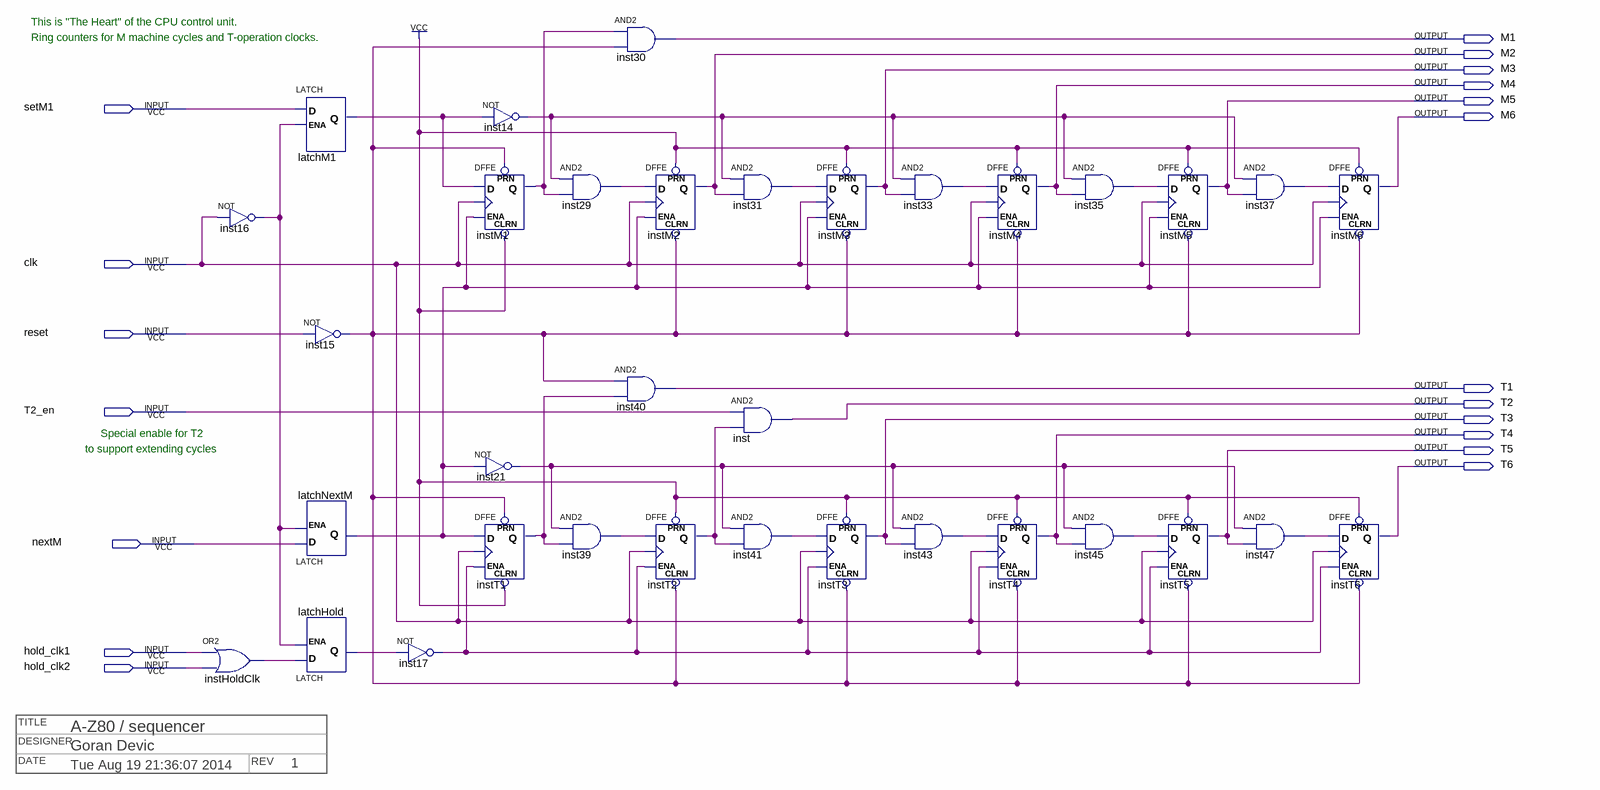
[diagram p0: schematic sheet]
// Quartus schematic sequencer.bdf as structural Verilog: 34 symbols, 19 pins
// Title block: TITLE: A-Z80 / sequencer; DESIGNER: Goran Devic; DATE: Tue Aug 19 21:36:07 2014; REV: 1
module sequencer (
  input  setM1,
  input  clk,
  input  reset,
  input  T2_en,
  input  nextM,
  input  hold_clk1,
  input  hold_clk2,
  output M1,
  output M2,
  output M3,
  output M4,
  output M5,
  output M6,
  output T1,
  output T2,
  output T3,
  output T4,
  output T5,
  output T6
);

  wire inst14_out, inst15_out, inst16_out, inst17_out, inst21_out, inst29_out, inst31_out, inst33_out,
       inst35_out, inst37_out, inst39_out, inst41_out, inst43_out, inst45_out, inst47_out, instHoldClk_out,
       instM1_q, instT1_q, instT2_q, latchHold_q, latchM1_q, latchNextM_q;

  not inst16 (inst16_out, clk);
  or instHoldClk (instHoldClk_out, hold_clk1, hold_clk2);
  LATCH latchM1 (.D(setM1), .ENA(inst16_out), .Q(latchM1_q));
  not inst15 (inst15_out, reset);
  LATCH latchNextM (.D(nextM), .ENA(inst16_out), .Q(latchNextM_q));
  LATCH latchHold (.D(instHoldClk_out), .ENA(inst16_out), .Q(latchHold_q));
  not inst17 (inst17_out, latchHold_q);
  not inst14 (inst14_out, latchM1_q);
  DFFE instM1 (.PRN(inst15_out), .CLRN(1'b1), .D(latchM1_q), .CLK(clk), .ENA(latchNextM_q), .Q(instM1_q));
  not inst21 (inst21_out, latchNextM_q);
  DFFE instT1 (.PRN(inst15_out), .CLRN(1'b1), .D(latchNextM_q), .CLK(clk), .ENA(inst17_out), .Q(instT1_q));
  and inst29 (inst29_out, inst14_out, instM1_q);
  and inst39 (inst39_out, inst21_out, instT1_q);
  and inst30 (M1, instM1_q, inst15_out);
  DFFE instM2 (.PRN(1'b1), .CLRN(inst15_out), .D(inst29_out), .CLK(clk), .ENA(latchNextM_q), .Q(M2));
  and inst40 (T1, inst15_out, instT1_q);
  DFFE instT2 (.PRN(1'b1), .CLRN(inst15_out), .D(inst39_out), .CLK(clk), .ENA(inst17_out), .Q(instT2_q));
  and inst31 (inst31_out, inst14_out, M2);
  and inst (T2, T2_en, instT2_q);
  and inst41 (inst41_out, inst21_out, instT2_q);
  DFFE instM3 (.PRN(1'b1), .CLRN(inst15_out), .D(inst31_out), .CLK(clk), .ENA(latchNextM_q), .Q(M3));
  DFFE instT3 (.PRN(1'b1), .CLRN(inst15_out), .D(inst41_out), .CLK(clk), .ENA(inst17_out), .Q(T3));
  and inst33 (inst33_out, inst14_out, M3);
  and inst43 (inst43_out, inst21_out, T3);
  DFFE instM4 (.PRN(1'b1), .CLRN(inst15_out), .D(inst33_out), .CLK(clk), .ENA(latchNextM_q), .Q(M4));
  DFFE instT4 (.PRN(1'b1), .CLRN(inst15_out), .D(inst43_out), .CLK(clk), .ENA(inst17_out), .Q(T4));
  and inst35 (inst35_out, inst14_out, M4);
  and inst45 (inst45_out, inst21_out, T4);
  DFFE instM5 (.PRN(1'b1), .CLRN(inst15_out), .D(inst35_out), .CLK(clk), .ENA(latchNextM_q), .Q(M5));
  DFFE instT5 (.PRN(1'b1), .CLRN(inst15_out), .D(inst45_out), .CLK(clk), .ENA(inst17_out), .Q(T5));
  and inst37 (inst37_out, inst14_out, M5);
  and inst47 (inst47_out, inst21_out, T5);
  DFFE instM6 (.PRN(1'b1), .CLRN(inst15_out), .D(inst37_out), .CLK(clk), .ENA(latchNextM_q), .Q(M6));
  DFFE instT6 (.PRN(1'b1), .CLRN(inst15_out), .D(inst47_out), .CLK(clk), .ENA(inst17_out), .Q(T6));

  // Notes on the sheet:
  //   This is "The Heart" of the CPU control unit.
  //   Ring counters for M machine cycles and T-operation clocks.
  //   Special enable for T2
  //   to support extending cycles
endmodule
